# Altium schematic sheet Bus Management_B3.SchDoc
size A3; SheetNumber: 1; SheetTotal: 3
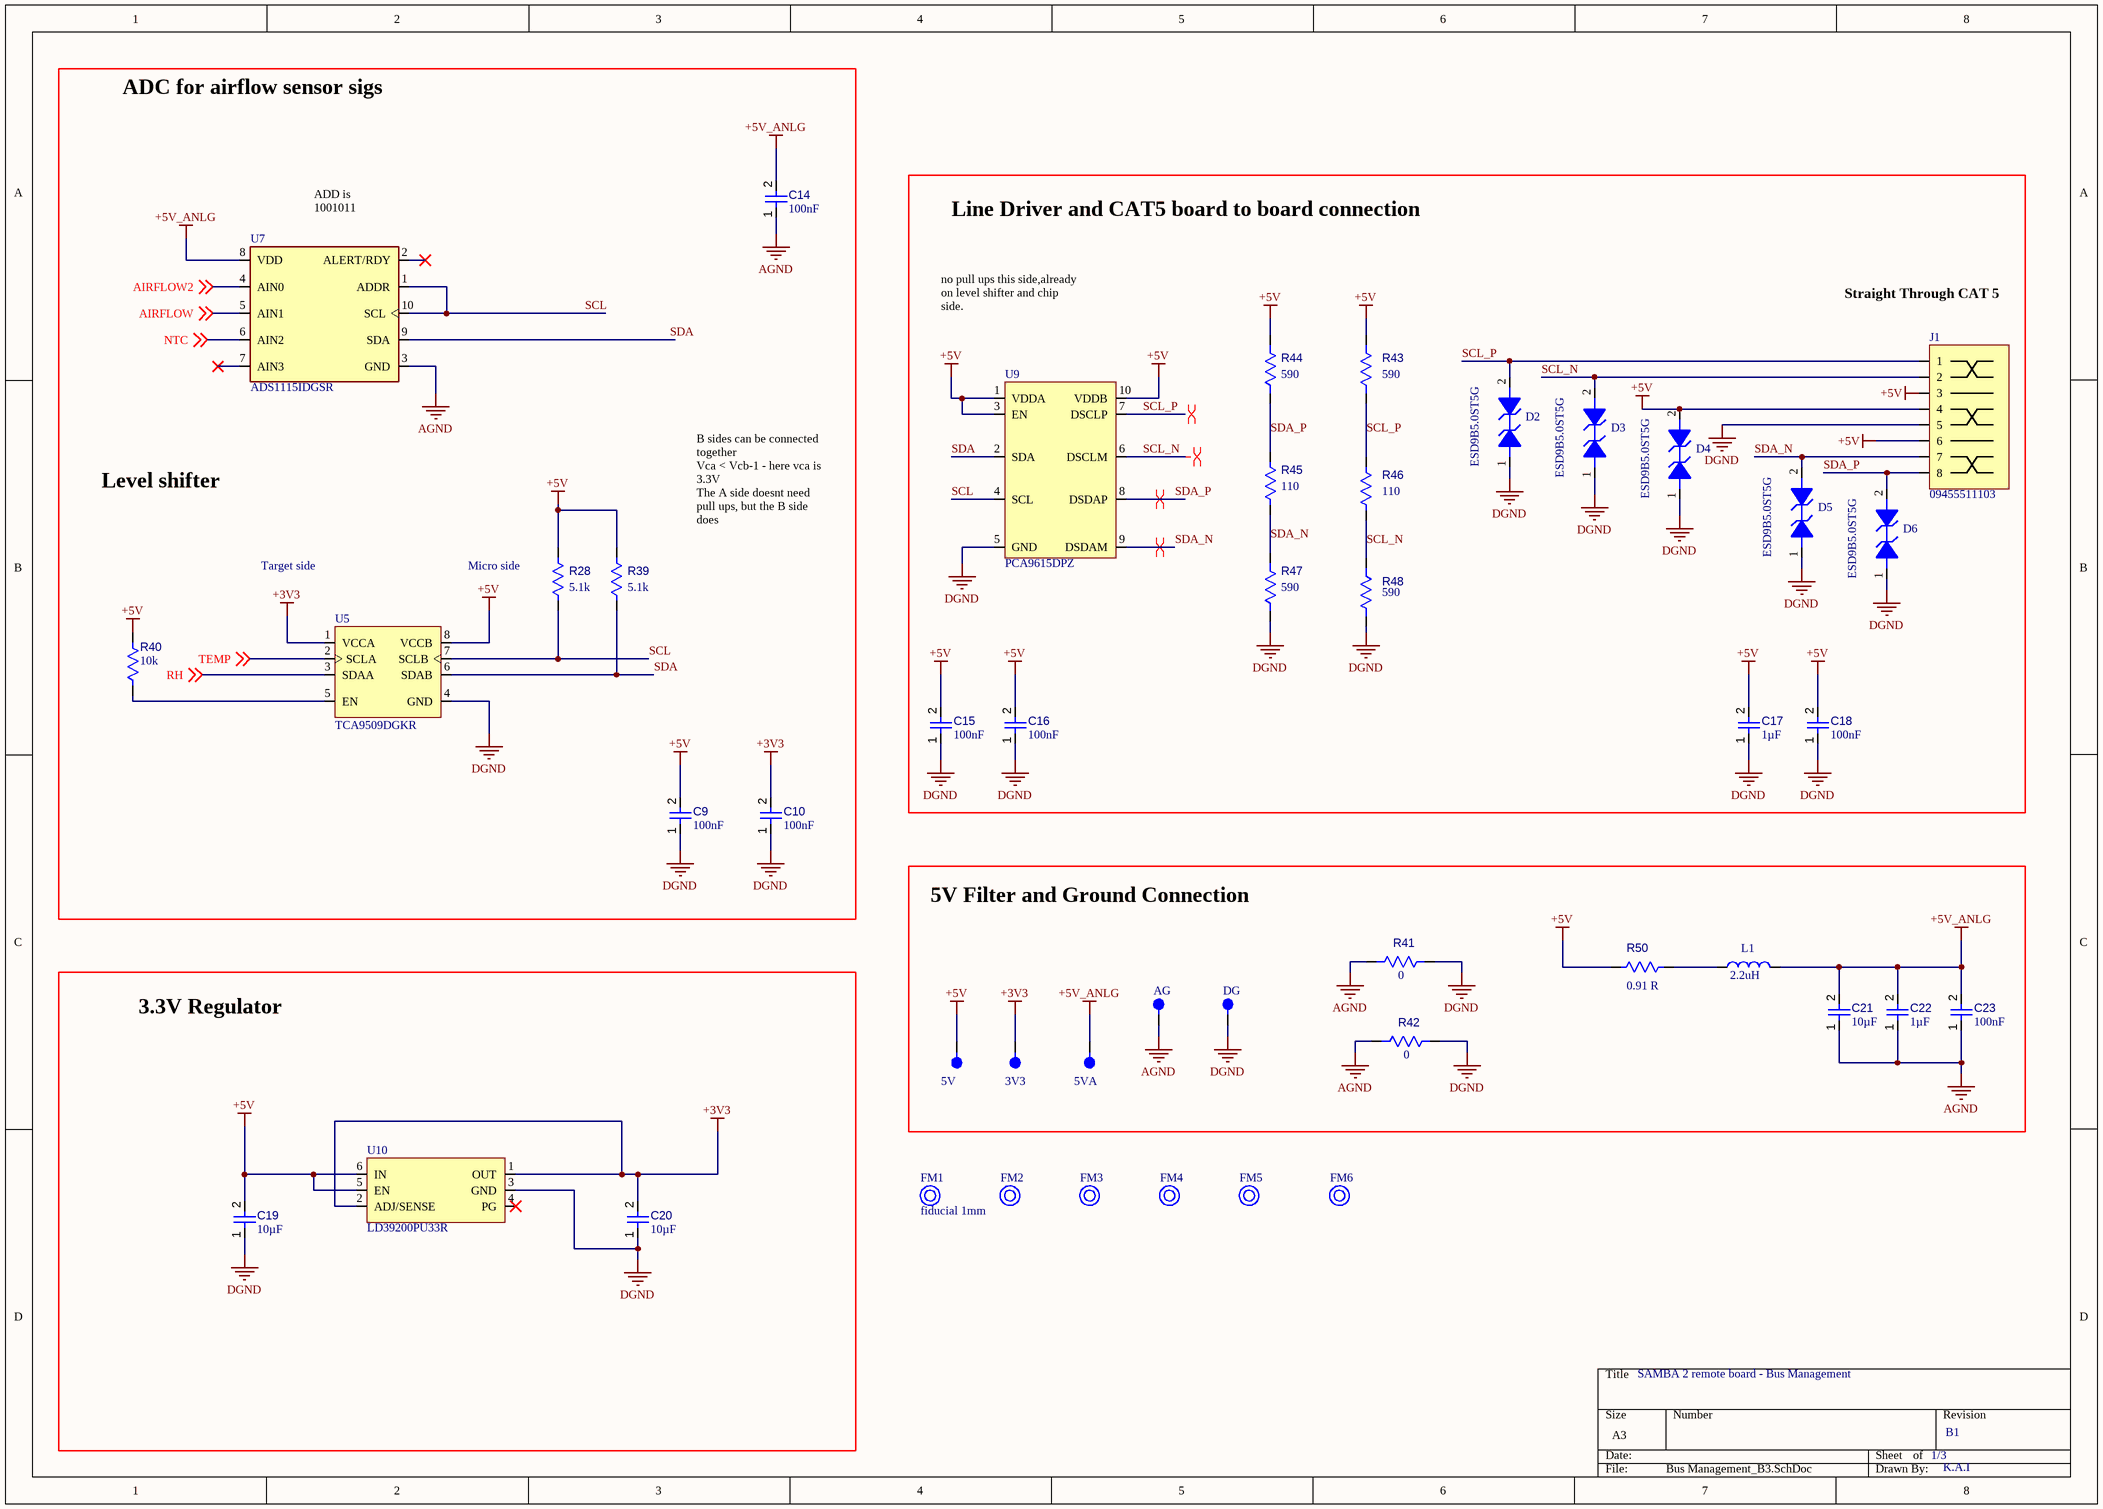
[diagram p0: Bus Management_B3.SchDoc]

## Parts
3V3  PH1-01-UA  [FP-PH1-01-UA-MFG]  (value not drawn)  (no BOM)
5V  PH1-01-UA  [FP-PH1-01-UA-MFG]  (value not drawn)  (no BOM)
5VA  PH1-01-UA  [FP-PH1-01-UA-MFG]  (value not drawn)  (no BOM)
AG  PH1-01-UA  [FP-PH1-01-UA-MFG]  (value not drawn)  (no BOM)
C9  value 100nF  [MANUF_CAP_0603]  (hidden comment: CC0603KRX7R7BB104)
C10  value 100nF  [MANUF_CAP_0603]  (hidden comment: CC0603KRX7R7BB104)
C14  value 100nF  [MANUF_CAP_0603]  (hidden comment: CC0603KRX7R7BB104)
C15  value 100nF  [MANUF_CAP_0603]  (hidden comment: CC0603KRX7R7BB104)
C16  value 100nF  [MANUF_CAP_0603]  (hidden comment: CC0603KRX7R7BB104)
C17  value 1µF  [MANUF_CAP_0603]  (hidden comment: CL10B105KA8NFNC)
C18  value 100nF  [MANUF_CAP_0603]  (hidden comment: CC0603KRX7R7BB104)
C19  value 10µF  [FP-CL21B106KOQNNNE-IPC_A]  (hidden comment: CL21B106KOQNNNE)
C20  value 10µF  [FP-CL21B106KOQNNNE-IPC_A]  (hidden comment: CL21B106KOQNNNE)
C21  value 10µF  [FP-GRM188-0_15-MFG]  (hidden comment: GRM188R61A106ME69D)
C22  value 1µF  [MANUF_CAP_0603]  (hidden comment: CL10B105KA8NFNC)
C23  value 100nF  [MANUF_CAP_0603]  (hidden comment: CC0603KRX7R7BB104)
D2  ESD9B5.0ST5G  [ONSC-SOD-923-2-514AB-01_V]
D3  ESD9B5.0ST5G  [ONSC-SOD-923-2-514AB-01_V]
D4  ESD9B5.0ST5G  [ONSC-SOD-923-2-514AB-01_V]
D5  ESD9B5.0ST5G  [ONSC-SOD-923-2-514AB-01_V]
D6  ESD9B5.0ST5G  [ONSC-SOD-923-2-514AB-01_V]
DG  PH1-01-UA  [FP-PH1-01-UA-MFG]  (value not drawn)  (no BOM)
FM1  fiducial 1mm  [fiducial 1mm-Footprint-1]  (no BOM)
FM2  fiducial 1mm  [fiducial 1mm-Footprint-1]  (value not drawn)  (no BOM)
FM3  fiducial 1mm  [fiducial 1mm-Footprint-1]  (value not drawn)  (no BOM)
FM4  fiducial 1mm  [fiducial 1mm-Footprint-1]  (value not drawn)  (no BOM)
FM5  fiducial 1mm  [fiducial 1mm-Footprint-1]  (value not drawn)  (no BOM)
FM6  fiducial 1mm  [fiducial 1mm-Footprint-1]  (value not drawn)  (no BOM)
J1  09455511103  [09455511103-Footprint-1]
L1  value 2.2uH  [INDC3225X06N]  (hidden comment: CC322522A-2R2K)
R28  value 5.1k  [0805]  (hidden comment: RC0805JR-075K1L)
R39  value 5.1k  [0805]  (hidden comment: RC0805JR-075K1L)
R40  value 10k  [MANUF_RES_0603]  (hidden comment: RC0603FR-0710KL)
R41  value 0  [MANUF_RES_0603]  (hidden comment: Resistor 0R +/- 5% 0603 100 mW)
R42  value 0  [MANUF_RES_0603]  (hidden comment: Resistor 0R +/- 5% 0603 100 mW)
R43  value 590  [MANUF_RES_0603]  (hidden comment: ERJ-3EKF5900V)
R44  value 590  [MANUF_RES_0603]  (hidden comment: ERJ-3EKF5900V)
R45  value 110  [MANUF_RES_0603]  (hidden comment: RMCF0603FT110R)
R46  value 110  [MANUF_RES_0603]  (hidden comment: RMCF0603FT110R)
R47  value 590  [MANUF_RES_0603]  (hidden comment: ERJ-3EKF5900V)
R48  value 590  [MANUF_RES_0603]  (hidden comment: ERJ-3EKF5900V)
R50  value 0.91 R  [RESC3116X06N]  (hidden comment: CRM1206-FX-R910ELF)
U5  TCA9509DGKR  [TSOP65P490X110-8N]
U7  ADS1115IDGSR  [FP-DGS0010A-MFG]
U9  PCA9615DPZ  [TSSOP50P490X110-10N]
U10  LD39200PU33R  [FP-DFN6-7946637-MFG]

## Blocks framed on the sheet
Line Driver and CAT5 board to board connection: C15-C18 D2-D6 J1 R43-R48 U9
5V Filter and Ground Connection: 3V3 5V 5VA AG C21-C23 DG L1 R41 R42 R50
3.3V Regulator: C19 C20 U10

## Nets
+3V3: 3V3.1 C10.2 C20.2 U5.1(VCCA) U10.1(OUT) U10.2(ADJ/SENSE)
+5V: 5V.1 C9.2 C15.2 C16.2 C17.2 C18.2 C19.2 D4.2(A2) J1.3 J1.4 J1.6 R28.2 R39.2 R40.2 R43.2 R44.2 R50.1 U5.8(VCCB) U9.1(VDDA) U9.3(EN) U9.10(VDDB) U10.5(EN) U10.6(IN)
+5V_ANLG: 5VA.1 C14.2 C21.2 C22.2 C23.2 L1.2 U7.8(VDD)
AGND: AG.1 C14.1 C21.1 C22.1 C23.1 R41.1 R42.1 U7.3(GND)
DGND: C9.1 C10.1 C15.1 C16.1 C17.1 C18.1 C19.1 C20.1 D2.1(A1) D3.1(A1) D4.1(A1) D5.1(A1) D6.1(A1) DG.1 J1.5 R41.2 R42.2 R47.1 R48.1 U5.4(GND) U9.5(GND) U10.3(GND)
AIRFLOW: U7.5(AIN1) ; off-sheet AIRFLOW
AIRFLOW2: U7.4(AIN0) ; off-sheet AIRFLOW2
NTC: U7.6(AIN2) ; off-sheet NTC
RH: U5.3(SDAA) ; off-sheet RH
SCL: R28.1 U5.7(SCLB) U7.1(ADDR) U7.10(SCL) U9.4(SCL)
SCL_N: D3.2(A2) J1.2 R46.1 R48.2 U9.6(DSCLM)
SCL_P: D2.2(A2) J1.1 R43.1 R46.2 U9.7(DSCLP)
SDA: R39.1 U5.6(SDAB) U7.9(SDA) U9.2(SDA)
SDA_N: D5.2(A2) J1.7 R45.1 R47.2 U9.9(DSDAM)
SDA_P: D6.2(A2) J1.8 R44.1 R45.2 U9.8(DSDAP)
TEMP: U5.2(SCLA) ; off-sheet TEMP
NetL1_1: L1.1 R50.2
NetR40_1: R40.1 U5.5(EN)

Not connected (* = marked no-connect by the designer): U7 2(ALERT/RDY)* 7(AIN3)*; U10 4(PG)*

## Layout directives
differential pair: SCL_N, SCL_P, SDA_N, SDA_P

## Notes on the sheet
- ADC for airflow sensor sigs
- (near U7) ADD is
  1001011
- no pull ups this side,already on level shifter and chip side.
- Straight Through CAT 5
- Level shifter
- Target side
- (near R28) Micro side
- B sides can be connected together
  Vca < Vcb-1 - here vca is 3.3V
  The A side doesnt need pull ups, but the B side does
- SAMBA 2 remote board - Bus Management
- 1/3
- B1
- K.A.I

## Library data of the parts
3V3 5V 5VA AG DG = CMP-002-00083-1: Conn Unshrouded Header HDR 1 POS 2.54mm Solder ST Thru-Hole Bag
C9 C10 C14-C16 C18 C23 = CMP-001-00099-4: Ceramic Capacitor, Multilayer, Ceramic, 16V, 10% +Tol, 10% -Tol, X7R, 15% TC, 0.1uF, Surface Mount, 0603; Pins: 2; Min Operating Temperature: -55°C; Max Operating Temperature: 125°C; Case/Package: 0603; RoHS Compliant: Yes; Mounting Technology: Surface Mount; Capacitor Type: Ceramic
C17 C22 = CMP-001-00098-2: Ceramic Capacitor, Multilayer, Ceramic, 25V, 10% +Tol, 10% -Tol, X7R, 15% TC, 1uF, Surface Mount, 0603; Pins: 2; Mounting Technology: Surface Mount; Min Operating Temperature: -55°C; Case/Package: 0603; Capacitor Type: Ceramic; RoHS Compliant: Yes; Max Operating Temperature: 125°C
C19 C20 = CMP-001-00101-1: Ceramic Capacitor, Multilayer, Ceramic, 16V, 10% +Tol, 10% -Tol, X7R, 15% TC, 10uF, Surface Mount, 0805; RoHS Compliant: Yes; Max Operating Temperature: 125°C; Capacitor Type: Ceramic; Pins: 2; Min Operating Temperature: -55°C; Case/Package: 0805; Mounting Technology: Surface Mount
C21 = CMP-001-00097-1: Ceramic Capacitor, Multilayer, Ceramic, 10V, 20% +Tol, 20% -Tol, X5R, 15% TC, 10uF, Surface Mount, 0603; Min Operating Temperature: -55°C; RoHS Compliant: Yes; Pins: 2; Capacitor Type: Ceramic; Max Operating Temperature: 85°C; Mounting Technology: Surface Mount; Case/Package: 0603
D2-D6 = CMP-004-00032-1: Trans Voltage Suppressor Diode, 5V V(RWM), Bidirectional, 1 Element, Silicon; Pins: 2; Max Operating Temperature: 150°C; RoHS Compliant: Yes; Min Operating Temperature: -55°C
FM1-FM6 = CMP-00030-00004-9: fiducial marker 2D
J1 = CMP-002-00071-6: Telecom and Datacom Connector, 8 Contact(s), Female, Straight, Solder Terminal, Locking, Jack; Mounting Technology: Board; RoHS Compliant: Yes; Max Operating Temperature: 70°C; Min Operating Temperature: -40°C; Connector Type: TELECOM AND DATACOM CONNECTOR
L1 = CMP-006-00022-2: General Purpose Inductor, 2.2uH, 10%, 1 Element, Ferrite-Core, SMD, 1110; RoHS Compliant: Yes
R28 R39 = CMP-009-00191-2: Fixed Resistor, Metal Glaze/thick Film, 0.125W, 5100ohm, 150V, 5% +/-Tol, 100ppm/Cel, Surface Mount, 0805; Power: 125mW; Min Operating Temperature: -55°C; Case/Package: 0805; Pins: 2; Max Operating Temperature: 155°C; Tolerance: 5%; Mounting Technology: Surface Mount; RoHS Compliant: Yes
R40 = CMP-009-00204-2: Fixed Resistor, Metal Glaze/thick Film, 0.1W, 10000ohm, 75V, 1% +/-Tol, 100ppm/Cel, Surface Mount, 0603; Power: 100mW; Pins: 2; Max Operating Temperature: 155°C; Case/Package: 0603; RoHS Compliant: Yes; Tolerance: 1%; Min Operating Temperature: -55°C; Mounting Technology: Surface Mount
R41 R42 = CMP-009-00006-8: Chip Resistor, 0 Ohm, 0.1 W, -55 to 155 degC, 0603 (1608 Metric); Power: 100mW; Voltage Rating: 50V; Max Operating Temperature: 155°C; RoHS Compliant: True; Mounting Technology: SM; Case/Package: 0603; Min Operating Temperature: -55°C; Tolerance: 5%; Pins: 2
R43 R44 R47 R48 = CMP-009-00193-4: Fixed Resistor, Metal Glaze/thick Film, 0.1W, 590ohm, 75V, 1% +/-Tol, 100ppm/Cel, Surface Mount, 0603; Power: 100mW; Tolerance: 1%; Pins: 2; Mounting Technology: Surface Mount; Max Operating Temperature: 155°C; Min Operating Temperature: -55°C; RoHS Compliant: Yes; Case/Package: 0603
R45 R46 = CMP-009-00194-4: Fixed Resistor, Metal Glaze/thick Film, 0.1W, 110ohm, 75V, 1% +/-Tol, 100ppm/Cel, Surface Mount, 0603; Power: 100mW; Tolerance: 1%; Min Operating Temperature: -55°C; Case/Package: 0603; RoHS Compliant: Yes; Pins: 2; Mounting Technology: Surface Mount; Max Operating Temperature: 155°C
R50 = CMP-009-00211-1: Fixed Resistor, Metal Glaze/thick Film, 0.5W, 0.91ohm, 0.675V, 1% +/-Tol, 100ppm/Cel, Surface Mount, 1206; Power: 500mW; Mounting Technology: Surface Mount; RoHS Compliant: Yes; Min Operating Temperature: -55°C; Pins: 2; Case/Package: 1206; Tolerance: 1%; Max Operating Temperature: 155°C
U5 = CMP-00024-00006-2: Interface Circuit, PDSO8; Pins: 8; Case/Package: TSSOP; Min Operating Temperature: -40°C; RoHS Compliant: Yes; Max Operating Temperature: 85°C
U7 = CMP-015-00008-1: ADC, Delta-Sigma, 16-Bit, 1 Func, 4 Channel, Serial Access, PDSO10; Nominal Supply Voltage: 3.3V; Min Operating Temperature: -40°C; Max Operating Temperature: 125°C; RoHS Compliant: Yes; Case/Package: TSSOP; Pins: 10
U9 = CMP-00024-00007-3: IC Redriver I2C 2CH 10TSSOP
U10 = CMP-019-00050-2: Fixed Positive LDO Regulator, 3.3V, 0.25V Dropout; Max Supply Voltage: 6V; Case/Package: HVSON; Pins: 6; RoHS Compliant: Yes